# Altium project PANNEL-BOARD.PrjPcb
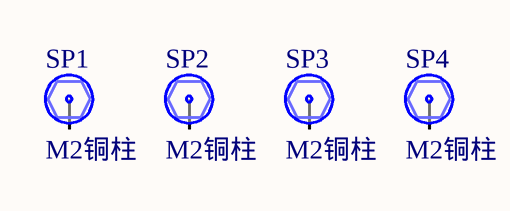
[diagram p0: PANNEL-BOARD.SchDoc]
1 sheet, 4 parts. Net scope: global (net labels, ports and power ports of the same name join across sheets).
Board file: PANNEL-BOARD.PcbDoc

## Sheet PANNEL-BOARD.SchDoc
size A4; SheetNumber: 1; SheetTotal: 1

### Parts
SP1  M2铜柱  [M2]
SP2  M2铜柱  [M2]
SP3  M2铜柱  [M2]
SP4  M2铜柱  [M2]

### Nets

Not connected (* = marked no-connect by the designer): SP1 1; SP2 1; SP3 1; SP4 1

### Library data of the parts
SP1-SP4 = M2铜柱: BOM名称: 铜柱; 版权归属: 源创客; 学习资源: www.ooocke.com